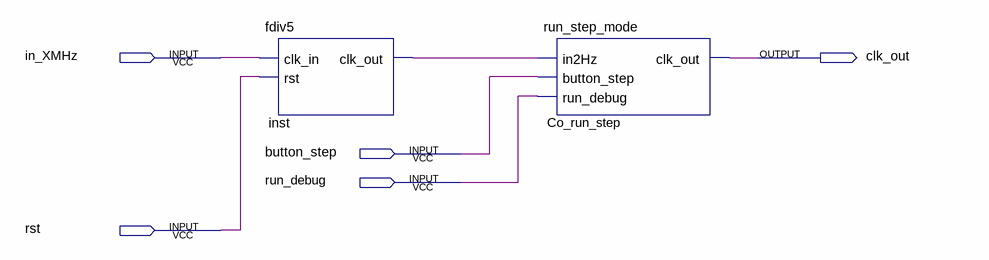
[diagram p0: schematic sheet]
// Quartus schematic test_run_step_mode.bdf as structural Verilog: 2 symbols, 5 pins
module test_run_step_mode (
  input  in_XMHz,
  input  button_step,
  input  run_debug,
  input  rst,
  output clk_out
);

  wire inst_clk_out;

  fdiv5 inst (.clk_in(in_XMHz), .rst(rst), .clk_out(inst_clk_out));
  run_step_mode Co_run_step (.in2Hz(inst_clk_out), .button_step(button_step), .run_debug(run_debug), .clk_out(clk_out));
endmodule
